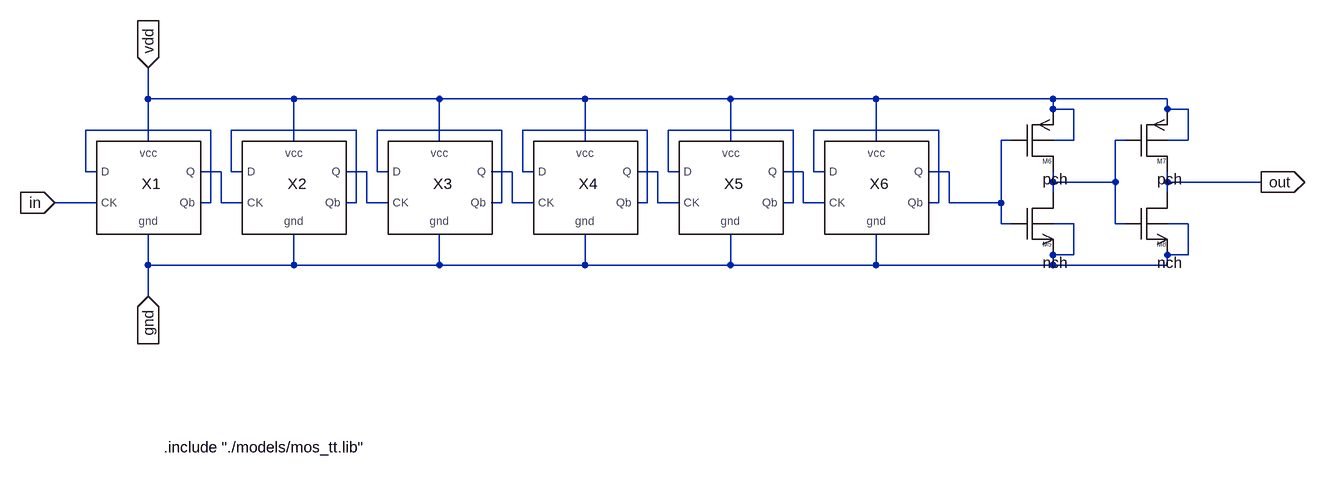
[diagram p0: schematic 64div.asc]
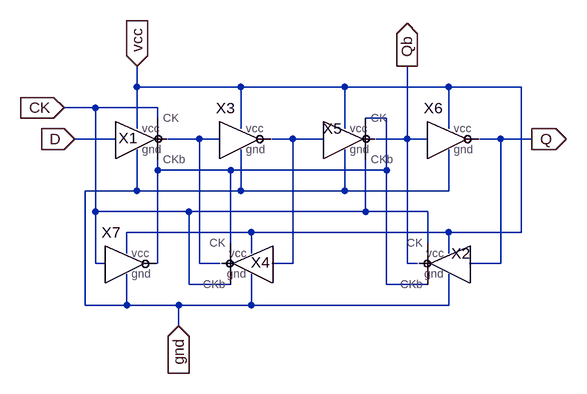
[diagram p1: sub-circuit mydff.asc]
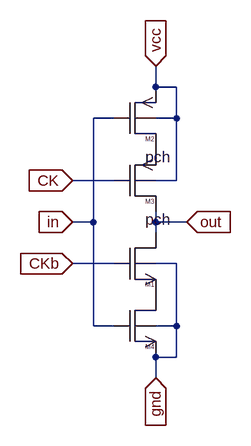
[diagram p2: sub-circuit myinv_c.asc]
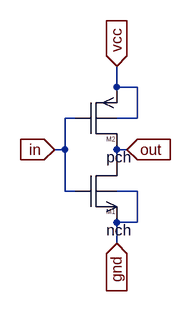
[diagram p3: sub-circuit myinv.asc]
64div.asc, the LTspice schematic file:
Version 4
SHEET 1 1896 696
WIRE 80 144 80 96
WIRE 304 144 80 144
WIRE 528 144 304 144
WIRE 752 144 528 144
WIRE 976 144 752 144
WIRE 1200 144 976 144
WIRE 1472 144 1200 144
WIRE 1648 144 1472 144
WIRE 1472 160 1472 144
WIRE 1504 160 1472 160
WIRE 1648 160 1648 144
WIRE 1680 160 1648 160
WIRE 176 192 -16 192
WIRE 400 192 208 192
WIRE 624 192 432 192
WIRE 848 192 656 192
WIRE 1072 192 880 192
WIRE 1296 192 1104 192
WIRE 80 208 80 144
WIRE 304 208 304 144
WIRE 528 208 528 144
WIRE 752 208 752 144
WIRE 976 208 976 144
WIRE 1200 208 1200 144
WIRE 1408 208 1392 208
WIRE 1504 208 1504 160
WIRE 1504 208 1472 208
WIRE 1584 208 1568 208
WIRE 1680 208 1680 160
WIRE 1680 208 1648 208
WIRE -16 256 -16 192
WIRE 0 256 -16 256
WIRE 192 256 160 256
WIRE 208 256 208 192
WIRE 224 256 208 256
WIRE 416 256 384 256
WIRE 432 256 432 192
WIRE 448 256 432 256
WIRE 640 256 608 256
WIRE 656 256 656 192
WIRE 672 256 656 256
WIRE 864 256 832 256
WIRE 880 256 880 192
WIRE 896 256 880 256
WIRE 1088 256 1056 256
WIRE 1104 256 1104 192
WIRE 1120 256 1104 256
WIRE 1312 256 1280 256
WIRE 1472 272 1472 256
WIRE 1568 272 1568 208
WIRE 1568 272 1472 272
WIRE 1648 272 1648 256
WIRE 1792 272 1648 272
WIRE 1472 288 1472 272
WIRE 1648 288 1648 272
WIRE 0 304 -64 304
WIRE 176 304 176 192
WIRE 176 304 160 304
WIRE 192 304 192 256
WIRE 224 304 192 304
WIRE 400 304 400 192
WIRE 400 304 384 304
WIRE 416 304 416 256
WIRE 448 304 416 304
WIRE 624 304 624 192
WIRE 624 304 608 304
WIRE 640 304 640 256
WIRE 672 304 640 304
WIRE 848 304 848 192
WIRE 848 304 832 304
WIRE 864 304 864 256
WIRE 896 304 864 304
WIRE 1072 304 1072 192
WIRE 1072 304 1056 304
WIRE 1088 304 1088 256
WIRE 1120 304 1088 304
WIRE 1296 304 1296 192
WIRE 1296 304 1280 304
WIRE 1312 304 1312 256
WIRE 1392 304 1392 208
WIRE 1392 304 1312 304
WIRE 1392 336 1392 304
WIRE 1408 336 1392 336
WIRE 1504 336 1472 336
WIRE 1568 336 1568 272
WIRE 1584 336 1568 336
WIRE 1680 336 1648 336
WIRE 1504 384 1504 336
WIRE 1504 384 1472 384
WIRE 1680 384 1680 336
WIRE 1680 384 1648 384
WIRE 80 400 80 352
WIRE 304 400 304 352
WIRE 304 400 80 400
WIRE 528 400 528 352
WIRE 528 400 304 400
WIRE 752 400 752 352
WIRE 752 400 528 400
WIRE 976 400 976 352
WIRE 976 400 752 400
WIRE 1200 400 1200 352
WIRE 1200 400 976 400
WIRE 1472 400 1472 384
WIRE 1472 400 1200 400
WIRE 1648 400 1648 384
WIRE 1648 400 1472 400
WIRE 80 448 80 400
FLAG 1792 272 out
IOPIN 1792 272 Out
FLAG -64 304 in
IOPIN -64 304 In
FLAG 80 448 gnd
IOPIN 80 448 In
FLAG 80 96 vdd
IOPIN 80 96 In
SYMBOL mydff 80 304 R0
SYMATTR InstName X1
SYMBOL mydff 304 304 R0
SYMATTR InstName X2
SYMBOL mydff 528 304 R0
SYMATTR InstName X3
SYMBOL mydff 752 304 R0
SYMATTR InstName X4
SYMBOL mydff 976 304 R0
SYMATTR InstName X5
SYMBOL mydff 1200 304 R0
SYMATTR InstName X6
SYMBOL nmos4 1408 336 R0
WINDOW 3 48 60 Left 2
SYMATTR InstName M5
SYMATTR Value nch
SYMATTR Value2 l=2u w=24u
SYMBOL pmos4 1408 208 R0
WINDOW 3 48 60 Left 2
SYMATTR InstName M6
SYMATTR Value pch
SYMATTR Value2 l=2u w=48u
SYMBOL pmos4 1584 208 R0
WINDOW 3 48 60 Left 2
SYMATTR InstName M7
SYMATTR Value pch
SYMATTR Value2 l=2u w=192u
SYMBOL nmos4 1584 336 R0
WINDOW 3 48 60 Left 2
SYMATTR InstName M8
SYMATTR Value nch
SYMATTR Value2 l=2u w=96u
TEXT 104 680 Left 2 !.include "./models/mos_tt.lib"\n

mydff.asc, the sub-circuit schematic file:
Version 4
SHEET 1 880 680
WIRE 176 64 176 32
WIRE 336 64 176 64
WIRE 496 64 336 64
WIRE 656 64 496 64
WIRE 768 64 656 64
WIRE 112 96 64 96
WIRE 208 96 112 96
WIRE 208 112 208 96
WIRE 560 112 528 112
WIRE 176 128 176 64
WIRE 336 128 336 64
WIRE 496 128 496 64
WIRE 656 128 656 64
WIRE 144 144 80 144
WIRE 272 144 224 144
WIRE 304 144 272 144
WIRE 416 144 384 144
WIRE 464 144 416 144
WIRE 592 144 592 32
WIRE 592 144 544 144
WIRE 624 144 592 144
WIRE 736 144 704 144
WIRE 784 144 736 144
WIRE 208 192 208 176
WIRE 320 192 208 192
WIRE 560 192 560 112
WIRE 560 192 320 192
WIRE 176 224 176 160
WIRE 176 224 96 224
WIRE 336 224 336 160
WIRE 336 224 176 224
WIRE 496 224 496 160
WIRE 496 224 336 224
WIRE 656 224 656 160
WIRE 656 224 496 224
WIRE 112 256 112 96
WIRE 256 256 112 256
WIRE 528 256 528 176
WIRE 528 256 256 256
WIRE 624 256 528 256
WIRE 352 288 160 288
WIRE 656 288 352 288
WIRE 768 288 768 64
WIRE 768 288 656 288
WIRE 320 304 320 192
WIRE 624 304 624 256
WIRE 160 320 160 288
WIRE 352 320 352 288
WIRE 656 320 656 288
WIRE 112 336 112 256
WIRE 128 336 112 336
WIRE 208 336 208 192
WIRE 272 336 272 144
WIRE 304 336 272 336
WIRE 416 336 416 144
WIRE 416 336 384 336
WIRE 592 336 592 144
WIRE 608 336 592 336
WIRE 736 336 736 144
WIRE 736 336 688 336
WIRE 256 368 256 256
WIRE 320 368 256 368
WIRE 560 368 560 192
WIRE 624 368 560 368
WIRE 96 400 96 224
WIRE 160 400 160 352
WIRE 160 400 96 400
WIRE 240 400 160 400
WIRE 352 400 352 352
WIRE 352 400 240 400
WIRE 656 400 656 352
WIRE 656 400 352 400
WIRE 240 432 240 400
FLAG 784 144 Q
IOPIN 784 144 Out
FLAG 592 32 Qb
IOPIN 592 32 Out
FLAG 80 144 D
IOPIN 80 144 In
FLAG 64 96 CK
IOPIN 64 96 In
FLAG 176 32 vcc
IOPIN 176 32 In
FLAG 240 432 gnd
IOPIN 240 432 In
SYMBOL myinv_c 176 160 R0
WINDOW 0 -14 -2 Bottom 2
SYMATTR InstName X1
SYMBOL myinv_c 656 352 M0
SYMATTR InstName X2
SYMBOL myinv 336 160 R0
SYMATTR InstName X3
SYMBOL myinv_c 352 352 M0
WINDOW 0 -14 -2 Bottom 2
SYMATTR InstName X4
SYMBOL myinv_c 496 160 R0
SYMATTR InstName X5
SYMBOL myinv 656 160 R0
SYMATTR InstName X6
SYMBOL myinv 160 352 R0
SYMATTR InstName X7

myinv_c.asc, the sub-circuit schematic file:
Version 4
SHEET 1 880 680
WIRE 176 32 176 0
WIRE 208 32 176 32
WIRE 112 80 80 80
WIRE 208 80 208 32
WIRE 208 80 176 80
WIRE 112 176 48 176
WIRE 208 176 208 80
WIRE 208 176 176 176
WIRE 80 240 80 80
WIRE 80 240 48 240
WIRE 176 240 176 224
WIRE 224 240 176 240
WIRE 176 256 176 240
WIRE 112 304 48 304
WIRE 208 304 176 304
WIRE 80 400 80 240
WIRE 112 400 80 400
WIRE 208 400 208 304
WIRE 208 400 176 400
WIRE 208 448 208 400
WIRE 208 448 176 448
WIRE 176 480 176 448
FLAG 176 480 gnd
IOPIN 176 480 In
FLAG 176 0 vcc
IOPIN 176 0 In
FLAG 48 240 in
IOPIN 48 240 In
FLAG 224 240 out
IOPIN 224 240 In
FLAG 48 176 CK
IOPIN 48 176 In
FLAG 48 304 CKb
IOPIN 48 304 In
SYMBOL nmos4 112 304 R0
SYMATTR InstName M1
SYMATTR SpiceModel nch
SYMATTR Value2 l=2u w=6u
SYMBOL pmos4 112 80 R0
WINDOW 3 48 60 Left 2
SYMATTR InstName M2
SYMATTR Value pch
SYMATTR Value2 l=2u w=18u
SYMBOL pmos4 112 176 R0
WINDOW 3 48 60 Left 2
SYMATTR InstName M3
SYMATTR Value pch
SYMATTR Value2 l=2u w=18u
SYMBOL nmos4 112 400 R0
SYMATTR InstName M4
SYMATTR SpiceModel nch
SYMATTR Value2 l=2u w=6u

myinv.asc, the sub-circuit schematic file:
Version 4
SHEET 1 880 680
WIRE 176 32 176 0
WIRE 208 32 176 32
WIRE 112 80 96 80
WIRE 208 80 208 32
WIRE 208 80 176 80
WIRE 96 128 96 80
WIRE 96 128 80 128
WIRE 192 128 176 128
WIRE 176 144 176 128
WIRE 96 192 96 128
WIRE 112 192 96 192
WIRE 208 192 176 192
WIRE 208 240 208 192
WIRE 208 240 176 240
WIRE 176 272 176 240
FLAG 176 272 gnd
IOPIN 176 272 In
FLAG 176 0 vcc
IOPIN 176 0 In
FLAG 80 128 in
IOPIN 80 128 In
FLAG 192 128 out
IOPIN 192 128 In
SYMBOL nmos4 112 192 R0
WINDOW 3 48 60 Left 2
SYMATTR InstName M1
SYMATTR Value nch
SYMATTR Value2 l=2u w=6u
SYMBOL pmos4 112 80 R0
WINDOW 3 48 60 Left 2
SYMATTR InstName M2
SYMATTR Value pch
SYMATTR Value2 l=2u w=18u

The netlist it stands for:
* 64div.asc
XX1 in N001 N009 N001 vdd gnd mydff
XX2 N009 N002 N010 N002 vdd gnd mydff
XX3 N010 N003 N011 N003 vdd gnd mydff
XX4 N011 N004 N012 N004 vdd gnd mydff
XX5 N012 N005 N013 N005 vdd gnd mydff
XX6 N013 N006 N007 N006 vdd gnd mydff
M5 N008 N007 gnd gnd nch l=2u w=24u
M6 N008 N007 vdd vdd pch l=2u w=48u
M7 out N008 vdd vdd pch l=2u w=192u
M8 out N008 gnd gnd nch l=2u w=96u

* block symbol definitions
.subckt mydff CK D Q Qb vcc gnd
XX1 gnd D N002 vcc CK N001 myinv_c
XX2 gnd Q Qb vcc CK N001 myinv_c
XX3 gnd N002 N003 vcc myinv
XX4 gnd N003 N002 vcc N001 CK myinv_c
XX5 gnd N003 Qb vcc N001 CK myinv_c
XX6 gnd Qb Q vcc myinv
XX7 gnd CK N001 vcc myinv
.ends mydff

.subckt myinv_c gnd in out vcc CK CKb
M1 out CKb P001 gnd nch l=2u w=6u
M2 P002 in vcc vcc pch l=2u w=18u
M3 out CK P002 vcc pch l=2u w=18u
M4 P001 in gnd gnd nch l=2u w=6u
.ends myinv_c

.subckt myinv gnd in out vcc
M1 out in gnd gnd nch l=2u w=6u
M2 out in vcc vcc pch l=2u w=18u
.ends myinv

.model NMOS NMOS
.model PMOS PMOS
.lib standard.mos
.include "./models/mos_tt.lib"
.backanno
.end